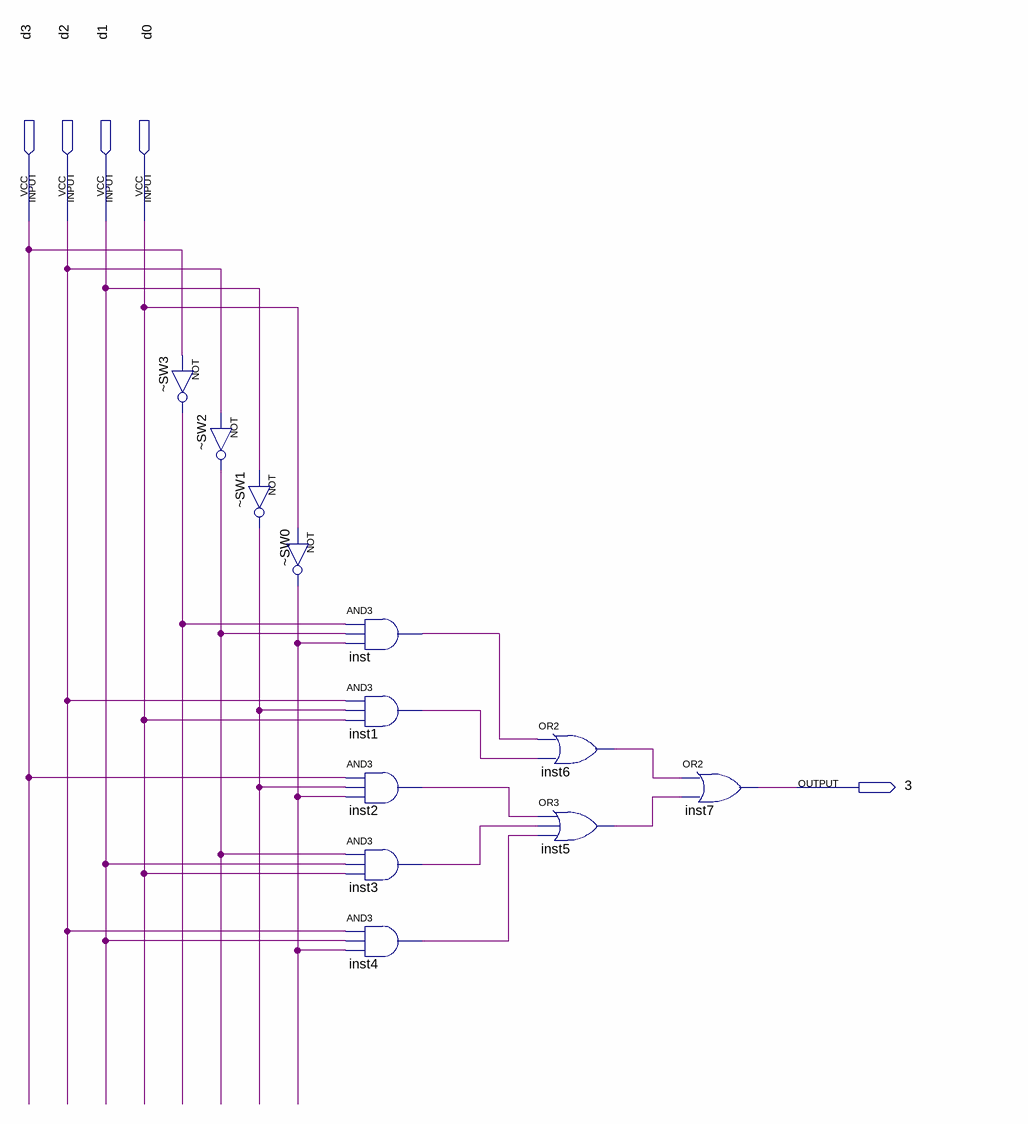
[diagram p0: schematic sheet]
// Quartus schematic 3.bdf as structural Verilog: 12 symbols, 5 pins
module \3  (
  input  d3,
  input  d2,
  input  d1,
  input  d0,
  output \3 
);

  wire _SW0_out, _SW1_out, _SW2_out, _SW3_out, inst1_out, inst2_out, inst3_out, inst4_out, inst5_out,
       inst6_out, inst_out;

  not \u_~SW3  (_SW3_out, d3);
  not \u_~SW2  (_SW2_out, d2);
  not \u_~SW1  (_SW1_out, d1);
  not \u_~SW0  (_SW0_out, d0);
  and inst (inst_out, _SW3_out, _SW2_out, _SW0_out);
  and inst1 (inst1_out, d2, _SW1_out, d0);
  and inst2 (inst2_out, d3, _SW1_out, _SW0_out);
  and inst3 (inst3_out, _SW2_out, d1, d0);
  and inst4 (inst4_out, d2, d1, _SW0_out);
  or inst6 (inst6_out, inst_out, inst1_out);
  or inst5 (inst5_out, inst2_out, inst3_out, inst4_out);
  or inst7 (\3 , inst6_out, inst5_out);
endmodule
